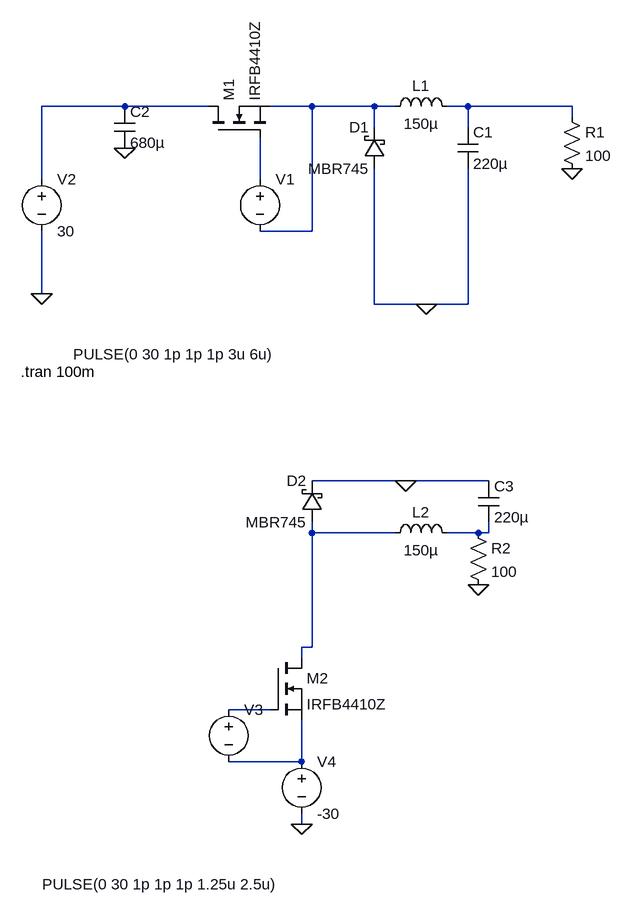
[diagram p0: schematic simusFuentes.asc]
simusFuentes.asc, the LTspice schematic file:
Version 4
SHEET 1 880 1300
WIRE -160 80 -288 80
WIRE -32 80 -160 80
WIRE 128 80 64 80
WIRE 224 80 128 80
WIRE 256 80 224 80
WIRE 368 80 336 80
WIRE 528 80 368 80
WIRE 528 96 528 80
WIRE 224 112 224 80
WIRE 368 112 368 80
WIRE -288 192 -288 80
WIRE 48 192 48 128
WIRE 128 272 128 80
WIRE 128 272 48 272
WIRE -288 368 -288 272
WIRE 224 384 224 176
WIRE 304 384 224 384
WIRE 368 384 368 176
WIRE 368 384 304 384
WIRE 272 656 128 656
WIRE 400 656 272 656
WIRE 128 736 128 720
WIRE 256 736 128 736
WIRE 384 736 336 736
WIRE 400 736 400 720
WIRE 400 736 384 736
WIRE 128 912 128 736
WIRE 128 912 112 912
WIRE 112 928 112 912
WIRE 64 1008 0 1008
WIRE 112 1088 112 1024
WIRE 112 1088 0 1088
WIRE 112 1184 112 1168
FLAG 304 384 0
FLAG 528 176 0
FLAG -288 368 0
FLAG -160 144 0
FLAG 272 656 0
FLAG 384 816 0
FLAG 112 1184 0
SYMBOL schottky 240 176 R180
WINDOW 0 24 64 Left 2
WINDOW 3 24 0 Left 2
SYMATTR InstName D1
SYMATTR Value MBR745
SYMATTR Description Diode
SYMATTR Type diode
SYMBOL ind 240 96 R270
WINDOW 0 32 56 VTop 2
WINDOW 3 5 56 VBottom 2
SYMATTR InstName L1
SYMATTR Value 150µ
SYMBOL cap 352 112 R0
SYMATTR InstName C1
SYMATTR Value 220µ
SYMBOL nmos -32 128 R270
SYMATTR InstName M1
SYMATTR Value IRFB4410Z
SYMBOL voltage 48 176 R0
WINDOW 3 -287 285 Left 2
WINDOW 123 0 0 Left 0
WINDOW 39 0 0 Left 0
SYMATTR Value PULSE(0 30 1p 1p 1p 3u 6u)
SYMATTR InstName V1
SYMBOL voltage -288 176 R0
WINDOW 123 0 0 Left 0
WINDOW 39 24 134 Left 2
SYMATTR InstName V2
SYMATTR Value 30
SYMBOL res 512 80 R0
SYMATTR InstName R1
SYMATTR Value 100
SYMBOL cap -176 80 R0
SYMATTR InstName C2
SYMATTR Value 680µ
SYMBOL schottky 144 720 R180
WINDOW 0 24 64 Left 2
WINDOW 3 24 0 Left 2
SYMATTR InstName D2
SYMATTR Value MBR745
SYMATTR Description Diode
SYMATTR Type diode
SYMBOL ind 240 752 R270
WINDOW 0 32 56 VTop 2
WINDOW 3 5 56 VBottom 2
SYMATTR InstName L2
SYMATTR Value 150µ
SYMBOL nmos 64 928 R0
SYMATTR InstName M2
SYMATTR Value IRFB4410Z
SYMBOL voltage 0 992 R0
WINDOW 3 -287 285 Left 2
WINDOW 123 0 0 Left 0
WINDOW 39 0 0 Left 0
SYMATTR Value PULSE(0 30 1p 1p 1p 1.25u 2.5u)
SYMATTR InstName V3
SYMBOL cap 384 656 R0
SYMATTR InstName C3
SYMATTR Value 220µ
SYMBOL res 368 720 R0
SYMATTR InstName R2
SYMATTR Value 100
SYMBOL voltage 112 1072 R0
WINDOW 123 0 0 Left 0
WINDOW 39 0 0 Left 0
SYMATTR InstName V4
SYMATTR Value -30
TEXT -320 488 Left 2 !.tran 100m

The netlist it stands for:
* simusFuentes.asc
D1 0 N002 MBR745
L1 N002 N003 150µ
C1 N003 0 220µ
M1 N001 N004 N002 N002 IRFB4410Z
V1 N004 N002 PULSE(0 30 1p 1p 1p 3u 6u)
V2 N001 0 30
R1 N003 0 100
C2 N001 0 680µ
D2 N005 0 MBR745
L2 N005 N006 150µ
M2 N005 N007 N008 N008 IRFB4410Z
V3 N007 N008 PULSE(0 30 1p 1p 1p 1.25u 2.5u)
C3 0 N006 220µ
R2 N006 0 100
V4 N008 0 -30
.model D D
.lib standard.dio
.model NMOS NMOS
.model PMOS PMOS
.lib standard.mos
.tran 100m
.backanno
.end